# Altium project Mazda3_IC_MITM.PrjPCB
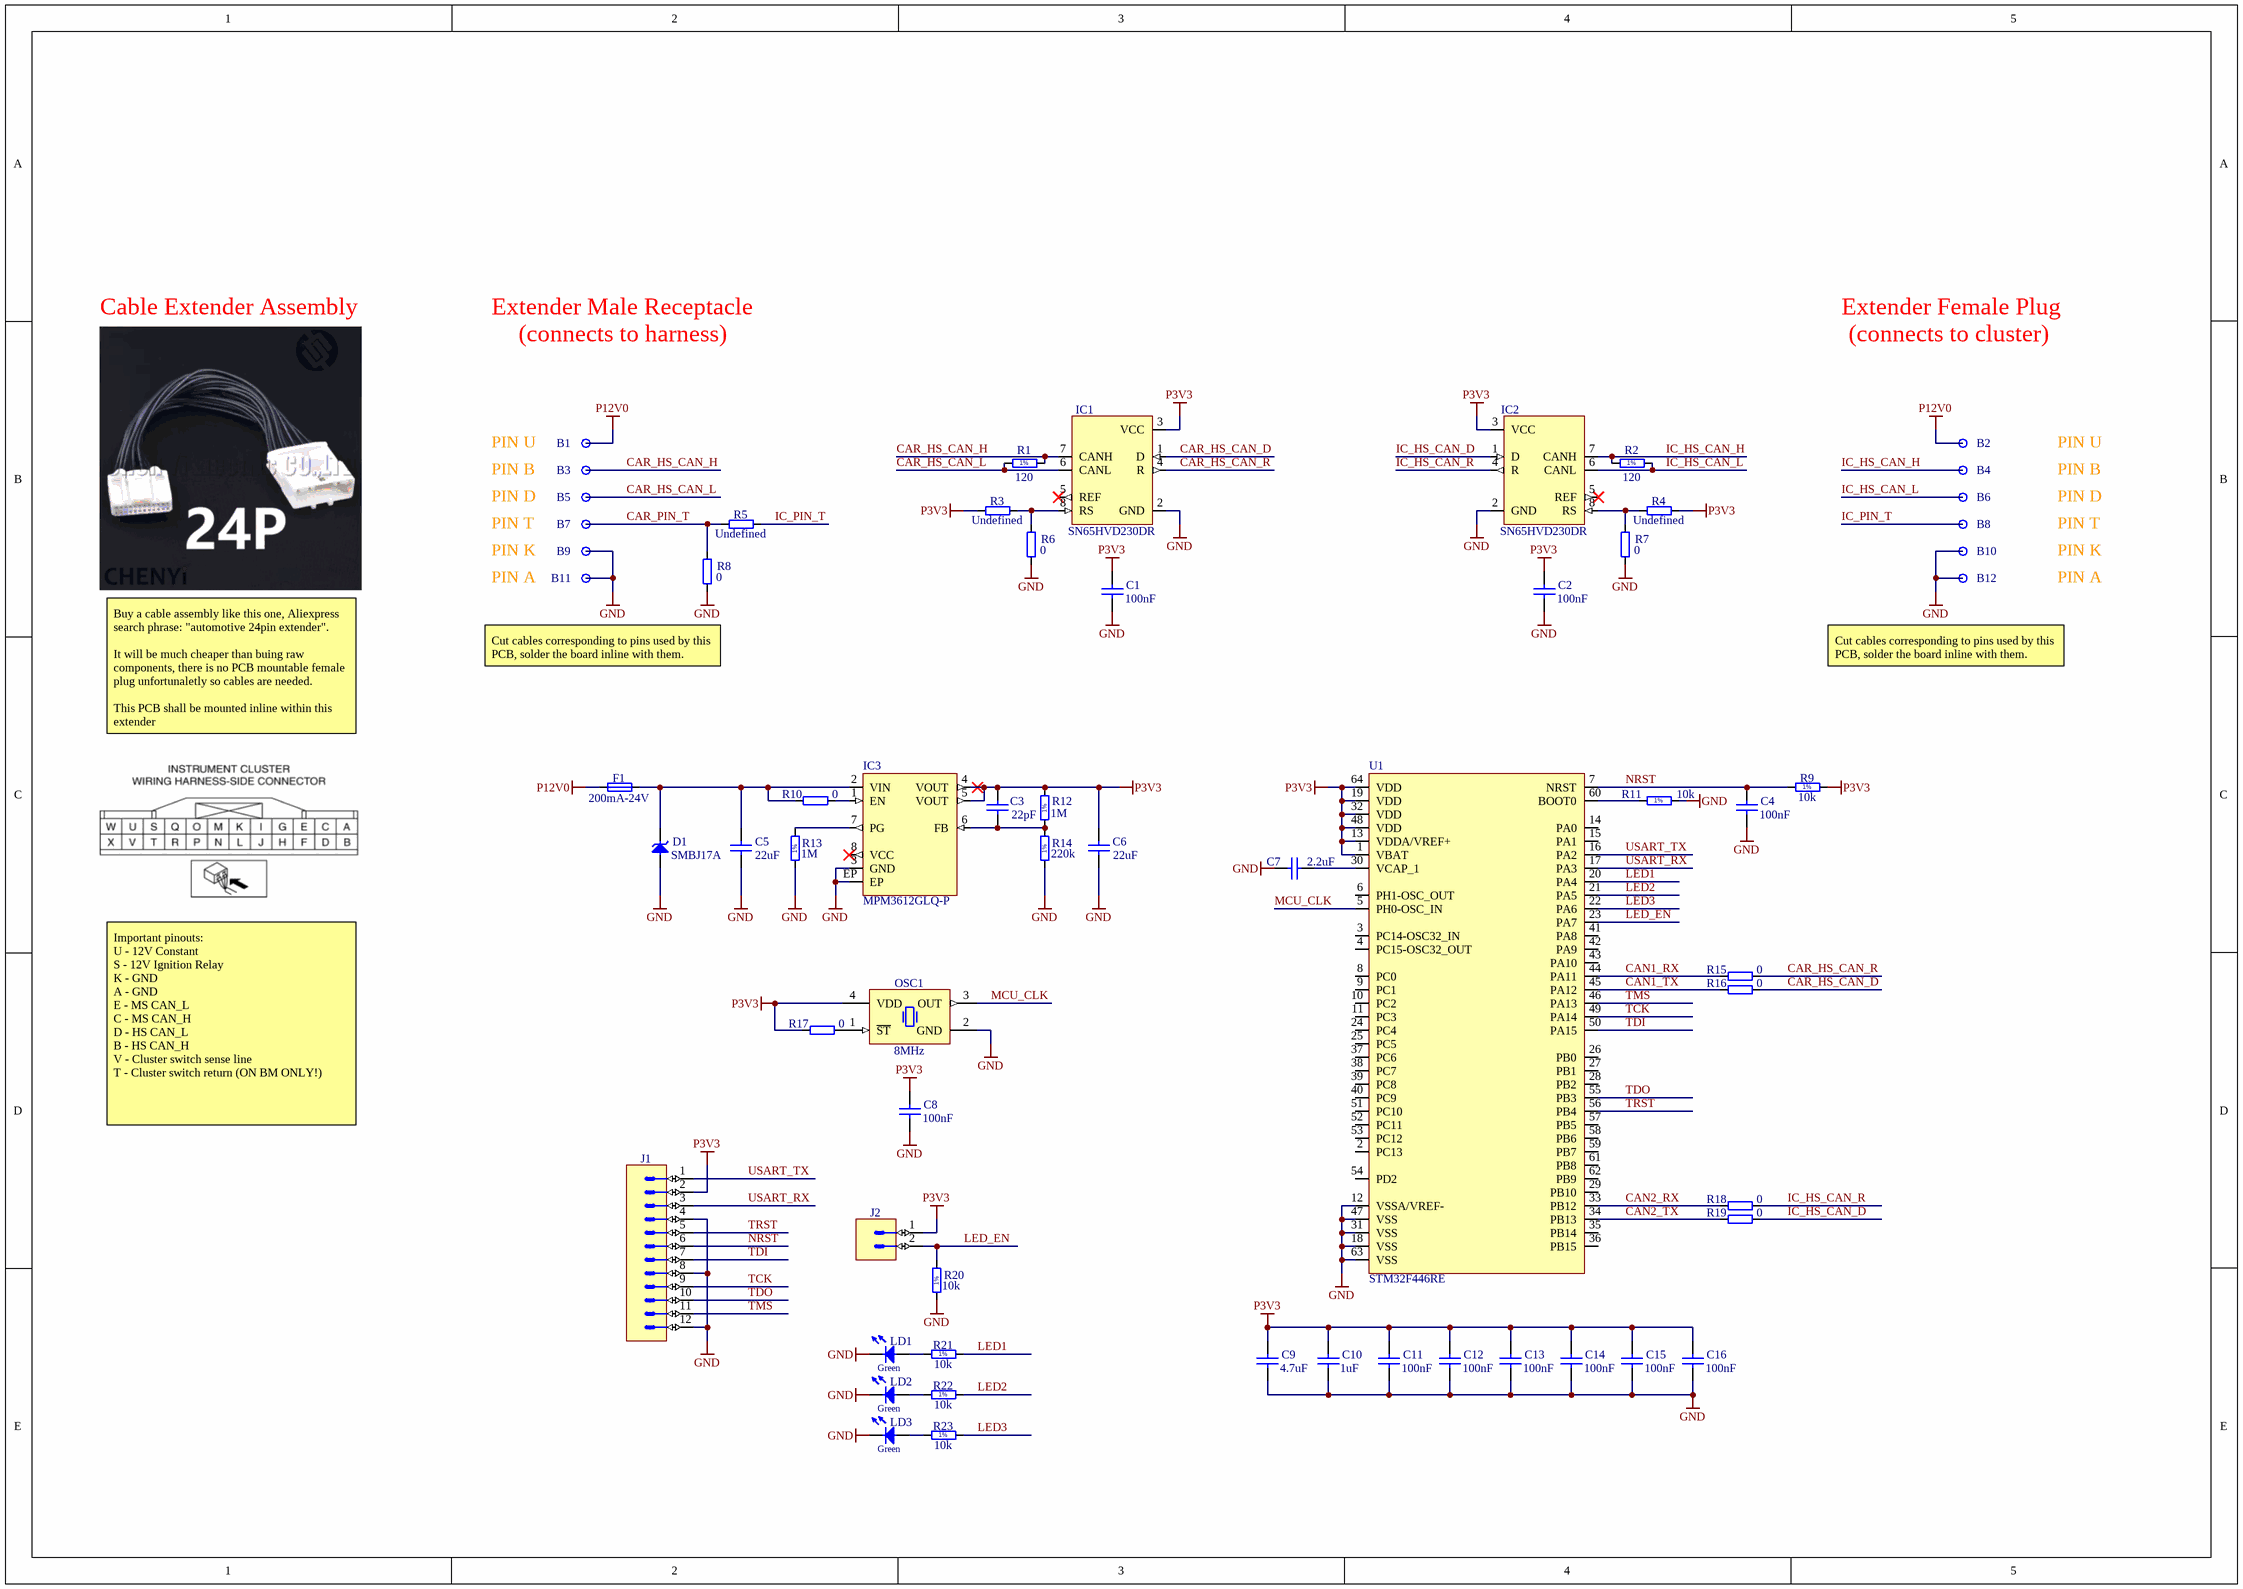
[diagram p0: Top.SchDoc]
P_version: 1.5.6
1 sheet, 63 parts. Net scope: hierarchical (ports join the sheet entries above them; power ports are global).
Board file: Pcb.PcbDoc

## Sheet Top.SchDoc: 3U DDS (URUKUL)
size 420 x 297 mm; Author: G.K.; CompanyName: WUT; DrawnBy: G.K.; Organization: WUT ISE; Address1: Warsaw Univeristy of Technology; Address2: Nowowiejska 15/19; DocumentNumber: 1; Revision: 1.5.6; SheetNumber: 1; SheetTotal: 7; EDA_Number: ARTIQ; Projet: ARTIQ/SINARA; ModifiedBy: -; CreateDate: XX/XX/XXXX; CheckedDate: -; Title2: Top entity; DivGrp: ISE; Designer: G.K.; ModifiedDate: -; ProjectName: ARTIQ/SINARA

### Parts
B1  Plated Hole  [c170h100]  (value not drawn)  (no BOM)
B2  Plated Hole  [c170h100]  (value not drawn)  (no BOM)
B3  Plated Hole  [c170h100]  (value not drawn)  (no BOM)
B4  Plated Hole  [c170h100]  (value not drawn)  (no BOM)
B5  Plated Hole  [c170h100]  (value not drawn)  (no BOM)
B6  Plated Hole  [c170h100]  (value not drawn)  (no BOM)
B7  Plated Hole  [c170h100]  (value not drawn)  (no BOM)
B8  Plated Hole  [c170h100]  (value not drawn)  (no BOM)
B9  Plated Hole  [c170h100]  (value not drawn)  (no BOM)
B10  Plated Hole  [c170h100]  (value not drawn)  (no BOM)
B11  Plated Hole  [c170h100]  (value not drawn)  (no BOM)
B12  Plated Hole  [c170h100]  (value not drawn)  (no BOM)
C1  100nF  [CAPC1608X87N]
C2  100nF  [CAPC1608X87N]
C3  22pF  [CAPC1608X87N]
C4  100nF  [CAPC1608X87N]
C5  22uF  [CAPC2012X135N]
C6  22uF  [CAPC2012X135N]
C7  2.2uF  [CAPC1608X90N]
C8  100nF  [CAPC1608X87N]
C9  4.7uF  [CAPC1608X87N]
C10  1uF  [CAPC1608X87N]
C11  100nF  [CAPC1608X87N]
C12  100nF  [CAPC1608X87N]
C13  100nF  [CAPC1608X87N]
C14  100nF  [CAPC1608X87N]
C15  100nF  [CAPC1608X87N]
C16  100nF  [CAPC1608X87N]
D1  SMBJ17A  [DIOM5336X265N]
F1  200mA-24V  [FUSR_LITTELFUSE_0805L010]
IC1  SN65HVD230DR  [SOIC127P600X175-8N]
IC2  SN65HVD230DR  [SOIC127P600X175-8N]
IC3  MPM3612GLQ-P  [LGA10]
J1  Header 12  [SAMTEC_TSW-106-23-L-D]  (value not drawn)
J2  Header 2  [SAMTEC_TSW-101-23-L-D]  (value not drawn)
LD1  Green  [LED_KINGBRIGHT_KPH-1608CGCK]
LD2  Green  [LED_KINGBRIGHT_KPH-1608CGCK]
LD3  Green  [LED_KINGBRIGHT_KPH-1608CGCK]
OSC1  8MHz  [OSC_MICROCHIP_CDFN2520-4LD-PL-1]
R1  120  [RESC3216X65N]
R2  120  [RESC3216X65N]
R3  Undefined  [RESC1608X55N]
R4  Undefined  [RESC1608X55N]
R5  Undefined  [RESC1608X55N]
R6  0  [RESC1608X55N]
R7  0  [RESC1608X55N]
R8  0  [RESC1608X55N]
R9  10k  [RESC1608X55N]
R10  0  [RESC1608X55N]
R11  10k  [RESC1608X55N]
R12  1M  [RESC1608X55N]
R13  1M  [RESC1608X55N]
R14  220k  [RESC1608X55N]
R15  0  [RESC1608X55N]
R16  0  [RESC1608X55N]
R17  0  [RESC1608X55N]
R18  0  [RESC1608X55N]
R19  0  [RESC1608X55N]
R20  10k  [RESC1608X55N]
R21  10k  [RESC1608X55N]
R22  10k  [RESC1608X55N]
R23  10k  [RESC1608X55N]
U1  STM32F446RE  [STM-LQFP64_N]

### Nets
GND: B9.1 B10.1 B11.1 B12.1 C1.1 C2.1 C4.1 C5.1 C6.1 C7.1 C8.1 C9.1 C10.1 C11.1 C12.1 C13.1 C14.1 C15.1 C16.1 D1.2(A) IC1.2(GND) IC2.2(GND) IC3.3(GND) IC3.EP J1.4 J1.8 J1.12 LD1.1(C) LD2.1(C) LD3.1(C) OSC1.2(GND) R6.1 R7.1 R8.1 R11.2 R13.1 R14.1 R20.1 U1.12(VSSA/VREF-) U1.18(VSS) U1.31(VSS) U1.47(VSS) U1.63(VSS)
P3V3: C1.2 C2.2 C3.2 C6.2 C8.2 C9.2 C10.2 C11.2 C12.2 C13.2 C14.2 C15.2 C16.2 IC1.3(VCC) IC2.3(VCC) IC3.4(VOUT) IC3.5(VOUT) J1.2 J2.1 OSC1.4(VDD) R3.2 R4.2 R9.2 R12.2 R17.2 U1.1(VBAT) U1.13(VDDA/VREF+) U1.19(VDD) U1.32(VDD) U1.48(VDD) U1.64(VDD)
P12V0: B1.1 B2.1 F1.1
CAN1_RX: R15.2 U1.44(PA11)
CAN1_TX: R16.2 U1.45(PA12)
CAN2_RX: R18.2 U1.33(PB12)
CAN2_TX: R19.2 U1.34(PB13)
CAR_HS_CAN_D: IC1.1(D) R16.1
CAR_HS_CAN_H: B3.1 IC1.7(CANH) R1.1
CAR_HS_CAN_L: B5.1 IC1.6(CANL) R1.2
CAR_HS_CAN_R: IC1.4(R) R15.1
CAR_PIN_T: B7.1 R5.1 R8.2
IC_HS_CAN_D: IC2.1(D) R19.1
IC_HS_CAN_H: B4.1 IC2.7(CANH) R2.1
IC_HS_CAN_L: B6.1 IC2.6(CANL) R2.2
IC_HS_CAN_R: IC2.4(R) R18.1
IC_PIN_T: B8.1 R5.2
LED1: R21.2 U1.20(PA4)
LED2: R22.2 U1.21(PA5)
LED3: R23.2 U1.22(PA6)
LED_EN: J2.2 R20.2 U1.23(PA7)
MCU_CLK: OSC1.3(OUT) U1.5(PH0-OSC_IN)
NRST: C4.2 J1.6 R9.1 U1.7(NRST)
TCK: J1.9 U1.49(PA14)
TDI: J1.7 U1.50(PA15)
TDO: J1.10 U1.55(PB3)
TMS: J1.11 U1.46(PA13)
TRST: J1.5 U1.56(PB4)
USART_RX: J1.3 U1.17(PA3)
USART_TX: J1.1 U1.16(PA2)
NetC3_1: C3.1 IC3.6(FB) R12.1 R14.2
NetC5_2: C5.2 D1.1(C) F1.2 IC3.2(VIN) R10.2
NetC7_2: C7.2 U1.30(VCAP_1)
NetIC1_8: IC1.8(RS) R3.1 R6.2
NetIC2_8: IC2.8(RS) R4.1 R7.2
NetIC3_1: IC3.1(EN) R10.1
NetIC3_7: IC3.7(PG) R13.2
NetLD1_2: LD1.2(A) R21.1
NetLD2_2: LD2.2(A) R22.1
NetLD3_2: LD3.2(A) R23.1
NetOSC1_1: OSC1.1(~{ST}) R17.1
NetR11_1: R11.1 U1.60(BOOT0)

Not connected (* = marked no-connect by the designer): IC1 5(REF)*; IC2 5(REF)*; IC3 8(VCC)*; U1 2(PC13) 3(PC14-OSC32_IN) 4(PC15-OSC32_OUT) 6(PH1-OSC_OUT) 8(PC0) 9(PC1) 10(PC2) 11(PC3) 14(PA0) 15(PA1) 24(PC4) 25(PC5) 26(PB0) 27(PB1) 28(PB2) 29(PB10) 35(PB14) 36(PB15) 37(PC6) 38(PC7) 39(PC8) 40(PC9) 41(PA8) 42(PA9) 43(PA10) 51(PC10) 52(PC11) 53(PC12) 54(PD2) 57(PB5) 58(PB6) 59(PB7) 61(PB8) 62(PB9)

### Notes on the sheet
- Cable Extender Assembly
- Extender Male Receptacle
- Extender Female Plug
- (connects to harness)
- (connects to cluster)
- PIN U
- PIN B
- PIN D
- PIN T
- PIN K
- PIN A
- Cut cables corresponding to pins used by this PCB, solder the board inline with them.
- Buy a cable assembly like this one, Aliexpress search phrase: "automotive 24pin extender".
  It will be much cheaper than buing raw components, there is no PCB mountable female plug unfortunaletly so cables are needed.
  This PCB shall be mounted inline within this extender
- Important pinouts:
  U - 12V Constant
  S - 12V Ignition Relay
  K - GND
  A - GND
  E - MS CAN_L
  C - MS CAN_H
  D - HS CAN_L
  B - HS CAN_H
  V - Cluster switch sense line
  T - Cluster switch return (ON BM ONLY!)
- (in symbol R0603_1M_1%_0.1W_100PPM) 1%
- (in symbol R0603_10K_1%_0.1W_100PPM) 1%
- (in symbol R0603_220K_1%_0.1W_100PPM) 1%
- (in symbol R1206_120R_1%_0.25W_100PPM) 1%

### Library data of the parts
B1-B12 = PLATED_HOLE1.0_PAD1.7: Single Terminal Socket; Part Description: Plated Through Hole: Hole Dia.=1.0mm Pad Dia.=1.7mm,  IPC-7251 Level A; Mounted: No; Part Number: PLATED_HOLE1.0_PAD1.7; Component Type: Standard (No BOM); Pin Count: 1; Family: Plated Hole; Socket: No; SMD: No; Sense: No; Status: None; ComponentHeight: 0mm; HelpURL: Undefined; Author: CERN DEM JLC; CreateDate: 11/05/2017; LatestRevisionDate: 11/05/2017; PackageDescription: Plated Through Hole: Hole Dia.=1.0mm Pad Dia.=1.7mm,  IPC-7251 Level A
C1 C2 C4 C8 C11-C16 = CC0603_100NF_50V_10%_X5R: Non-polarised capacitor; Part Description: SMD Multilayer Chip Ceramic Capacitor; Manufacturer: GENERIC; Manufacturer1: TDK; Manufacturer1 Part Number: C1608X5R1H104K080AA; Voltage: 50V; TC: X5R; Tolerance: ±10%; Part Number: CC0603_100NF_50V_10%_X5R; Component Kind: Standard; Component Type: Standard; Pin Count: 2; Value: 100nF; Status: None; Manufacturer Part Number: CC0603_100NF_50V_10%_X5R; Case: 0603; Mounted: Yes; Socket: No; SMD: Yes; Sense: No; Manufacturer1 ComponentHeight: 0.9mm; HelpURL: \\cern.ch\dfs\Applications\Altium\Datasheets\CC0603_X5R_TDK_C.pdf; Author: CERN DEM MR; CreateDate: 08/01/2016; LatestRevisionDate: 08/01/2016
C3 = CC0603_22PF_50V_5%_NP0: Non-polarised capacitor; Part Description: SMD Multilayer Chip Ceramic Capacitor; Manufacturer: GENERIC; Manufacturer1: PHYCOMP; Manufacturer1 Part Number: 223886715229; Voltage: 50V; TC: C0G/NP0; Tolerance: ±5%; Part Number: CC0603_22PF_50V_5%_NP0; Component Kind: Standard; Component Type: Standard; Pin Count: 2; Value: 22pF; Status: Preferred; Manufacturer Part Number: CC0603_22PF_50V_5%_NP0; Case: 0603; Mounted: Yes; Socket: No; SMD: Yes; Sense: No; Manufacturer1 ComponentHeight: 0.87mm; HelpURL: \\cern.ch\dfs\Applications\Altium\Datasheets\CC0603_NP0_PHYCOMP.pdf; Author: CERN DEM JLC; CreateDate: 03/12/2007; LatestRevisionDate: 03/12/2007
C5 C6 = CC0805_22UF_16V_10%_X5R: Non-polarised capacitor; Part Number: CC0805_22UF_25V_20%_X6S; Part Description: SMD Multilayer Chip Ceramic Capacitor; Manufacturer: GENERIC; Manufacturer1: Samsung; Manufacturer1 Part Number: CL21X226MAYNNWE; Voltage: 25V; TC: X6S; Tolerance: ±20%; Component Kind: Standard; Component Type: Standard; Pin Count: 2; Value: 22uF; Status: Preferred; Manufacturer Part Number: CC0805_22UF_25V_20%_X6S; Case: 0805; Mounted: Yes; Socket: No; SMD: Yes; Sense: No; Manufacturer1 ComponentHeight: 1.35mm; HelpURL: \\cern.ch\dfs\Applications\Altium\Datasheets\CC0805_X5R_TDK_C.pdf; Author: CERN DEM JLC; CreateDate: 25/10/2012; LatestRevisionDate: 25/10/2012
C7 = CC0603_2.2UF_10V_20%_X7R: Non-polarised capacitor; Part Description: SMD Multilayer Chip Ceramic Capacitor; Manufacturer: GENERIC; Manufacturer1: TAIYO YUDEN; Manufacturer1 Part Number: LMK107B7225MA-T; Voltage: 10V; TC: X7R; Tolerance: ±20%; Part Number: CC0603_2.2UF_10V_20%_X7R; Component Kind: Standard; Component Type: Standard; Pin Count: 2; Value: 2.2uF; Status: Not Recommended; Manufacturer Part Number: CC0603_2.2UF_10V_20%_X7R; Case: 0603; Mounted: Yes; Socket: No; SMD: Yes; Sense: No; Manufacturer1 ComponentHeight: 0.9mm; HelpURL: \\cern.ch\dfs\Applications\Altium\Datasheets\CC0603_X7R_TAIYO-YUDEN_HIGH-VALUE.pdf; Author: CERN DEM JLC; CreateDate: 22/06/2011; LatestRevisionDate: 27/06/2011
C9 = CC0603_4.7UF_6.3V_10%_X5R: Non-polarised capacitor; Part Description: SMD Multilayer Chip Ceramic Capacitor; Manufacturer: GENERIC; Manufacturer1: PHYCOMP; Manufacturer1 Part Number: 225520613672; Voltage: 6.3V; TC: X5R; Tolerance: ±10%; Part Number: CC0603_4.7UF_6.3V_10%_X5R; Component Kind: Standard; Component Type: Standard; Pin Count: 2; Value: 4.7uF; Status: Preferred; Manufacturer Part Number: CC0603_4.7uF_6.3V_10%_X5R; Case: 0603; Mounted: Yes; Socket: No; SMD: Yes; Sense: No; Manufacturer1 ComponentHeight: 0.87mm; HelpURL: \\cern.ch\dfs\Applications\Altium\Datasheets\CC0805_X5R_PHYCOMP_HC.pdf; Author: CERN DEM JLC; CreateDate: 03/12/2007; LatestRevisionDate: 03/12/2007
C10 = CC0603_1UF_16V_10%_X7R: Non-polarised capacitor; Part Description: SMD Multilayer Chip Ceramic Capacitor; Manufacturer: GENERIC; Manufacturer1: YAGEO PHYCOMP; Manufacturer1 Part Number: 223878615663; Voltage: 16V; TC: X7R; Tolerance: ±10%; Part Number: CC0603_1UF_16V_10%_X7R; Component Kind: Standard; Component Type: Standard; Pin Count: 2; Value: 1uF; Status: None; Manufacturer Part Number: CC0603_1uF_16V_10%_X7R; Case: 0603; Mounted: Yes; Socket: No; SMD: Yes; Sense: No; Manufacturer1 ComponentHeight: 0.9mm; HelpURL: \\cern.ch\dfs\Applications\Altium\Datasheets\CC0603_X7R_PHYCOMP.pdf; Author: CERN DEM JLC; CreateDate: 03/12/2007; LatestRevisionDate: 17/04/2015
D1 = SMBJ15A: Zener Diode; Part Description: Uni-Directional Transient Voltage Suppressor Diode; Manufacturer1: FAIRCHILD SEMICONDUCTOR; Voltage: 17V; Power: 600W; PressFit: No; Bonding: No; Part Number: SMBJ17A; Component Kind: Standard; Component Type: Standard; Device: SMBJ17A; PackageDescription: DO-214-AA/SMB Diode, Molded Body; 5.34mm L X 3.625mm W X 2.65mm H, IPC Medium Density; Manufacturer1 Part Number: SMBJ17A; Pin Count: 2; Case: DO-214AA; Mounted: Yes; Socket: No; SMD: Yes; Sense: No; ComponentHeight: 2.65mm; HelpURL: \\cern.ch\dfs\Applications\Altium\Datasheets\SMBJ.pdf; Author: CERN DEM JLC; CreateDate: 08.12.2008; LatestRevisionDate: 19.12.2011
F1 = FUSR_LITTELFUSE_0805L010YR: Fuse; Part Number: 0805L020/24YR; Part Description: POLYFUSE® Surface Mount Resettable PTC; PressFit: No; Component Kind: Standard; Component Type: Standard; Footprint: 0805L; Pin Count: 2; PackageDescription: Surface Mount POLY-FUSE® Resettable PTC, 0805L Series; Family: Fuses Resettable; Mounted: Yes; Socket: No; SMD: Yes; Sense: No; Value: 200mA-24V; Manufacturer1: LITTELFUSE; Manufacturer1 Part Number: 0805L020/24YR; ComponentHeight: 1mm; HelpURL: \\cern.ch\dfs\Applications\Altium\Datasheets\FUSR_LITTELFUSE_0805L010YR.pdf; Author: CERN DEM JLC; CreateDate: 11/09/2012; LatestRevisionDate: 11/09/2012
IC1 IC2 = SN65HVD230DR: 3.3V CAN Bus Transceiver; Manufacturer1: TEXAS INSTRUMENTS; PressFit: No; Bonding: No; Part Number: SN65HVD230DR; Component Kind: Standard; Component Type: Standard; Device: SN65HVD230DR; PackageDescription: SOIC 8, Pitch 1.27mm, Body 4x5mm, IPC Medium Density; Part Description: 3.3V CAN Bus Transceiver; Manufacturer1 Part Number: SN65HVD230DR; Pin Count: 8; Case: SOIC8; Mounted: Yes; Socket: No; SMD: Yes; Sense: No; ComponentHeight: 1.75mm; Author: CERN DEM JMW; HelpURL: \\cern.ch\dfs\Applications\Altium\Datasheets\SN65HVD233DG4.pdf; CreateDate: 22/10/2015; LatestRevisionDate: 22/10/2015
IC3 = MPM3612GLQ-P: Manufacturer1: MPS; Part Number: MPM3612GLQ-P; Manufacturer1 Part Number: MPM3612GLQ-P
J1 = SAMTEC_TSW-106-23-L-D: Connector 12 Male; Part Description: 12 Contacts, Pitch 2.54mm, Dual Row Through Mount Straight Header (Post Lead 5.84mm, Tail Lead 2.92mm, Insulator 2.54mm); Manufacturer1: SAMTEC; PressFit: No; Part Number: SAMTEC_TSW-106-23-L-D; Component Kind: Standard; Component Type: Standard; Pin Count: 12; Family: Header 12; Mounted: Yes; Socket: No; SMD: No; Sense: No; Status: None; Manufacturer1 Part Number: TSW-106-23-L-D; ComponentHeight: 8.38mm; HelpURL: \\cern.ch\dfs\Applications\Altium\Datasheets\SAMTEC_TSW-106-23-L-D.pdf; Author: CERN DEM MR; CreateDate: 08/03/2017; LatestRevisionDate: 08/03/2017
J2 = SAMTEC_TSW-101-23-L-D: Connector 2 Male; Part Description: 2 Contacts, Pitch 2.54mm, Dual Row Through Mount Straight Header (Post Lead 5.84mm, Tail Lead 2.92mm, Insulator 2.54mm); Manufacturer1: SAMTEC; PressFit: No; Part Number: SAMTEC_TSW-101-23-L-D; Component Kind: Standard; Component Type: Standard; Pin Count: 2; Family: Header 2; Mounted: Yes; Socket: No; SMD: No; Sense: No; Status: None; Manufacturer1 Part Number: TSW-101-23-L-D; ComponentHeight: 8.38mm; HelpURL: \\cern.ch\dfs\Applications\Altium\Datasheets\SAMTEC_TSW-101-23-L-D.pdf; Author: CERN DEM MR; CreateDate: 08/03/2017; LatestRevisionDate: 08/03/2017
LD1-LD3 = LED_KINGBRIGHT_KPH-1608CGCK: LED Green 1C 2A; Part Description: SMD Green LED, Case 1.6mmX0.8mm(0603), 0.65mm Thickness; PressFit: No; Bonding: No; Part Number: LED_KINGBRIGHT_KPH-1608CGCK; Component Kind: Standard; Component Type: Standard; Color: Green; PackageDescription: SMT Green LED, Case 0603, Body L 1.6 x W 0.8mm H 0.65mm; Manufacturer1: KINGBRIGHT; Manufacturer1 Part Number: KPH-1608CGCK; Pin Count: 2; Mounted: Yes; Socket: No; SMD: Yes; Sense: No; ComponentHeight: 0.65mm; HelpURL: \\cern.ch\dfs\Applications\Altium\Datasheets\LED_KINGBRIGHT_KPH-1608CGCK.pdf; Author: CERN DEM JLC; CreateDate: 03/07/2017; LatestRevisionDate: 03/07/2017
OSC1 = OSC_25MHZ_MICROCHIP_DSC1003DL5-025.0000: Oscillator 4 pins 1=S\T\ 2=GND 3=OUT 4=VDD; Part Number: OSC_8MHZ_MICROCHIP_DSC1003DL2-008.0000; Part Description: 1.8V-3.3V, ±10ppm, 25pF, -40..105°C, Surface Mount Low-Power Precision CMOS Oscillator (DSC1001 Series); Manufacturer1: MICROCHIP TECHNOLOGY; Manufacturer1 Part Number: DSC1003DL2-008.0000; PressFit: No; Bonding: No; Component Kind: Standard; Component Type: Standard; PackageDescription: MICROCHIP Case CDFN2520-4LD-PL-1, SMD Oscillator, DFN, 4 pins, 2.5mm x 2.0mm; Value: 8MHz; Pin Count: 4; Mounted: Yes; Socket: No; SMD: Yes; Sense: No; ComponentHeight: 0.9mm; HelpURL: \\cern.ch\dfs\Applications\Altium\Datasheets\OSC_MICROCHIP_DSC1003.pdf; Author: CERN DEM JLC; CreateDate: 16/08/2018; LatestRevisionDate: 16/08/2018
R1 R2 = R1206_120R_1%_0.25W_100PPM: Resistor - 1%; Part Description: General Purpose Thick Film Chip Resistor; Manufacturer: GENERIC; Manufacturer1: NIC COMPONENT; Manufacturer1 Part Number: NRC12F1200TRF; Power: 0.25W; TC: ±100ppm/°C; PressFit: No; Part Number: R1206_120R_1%_0.25W_100PPM; Component Kind: Standard; Component Type: Standard; Pin Count: 2; Value: 120; Status: Preferred; Tolerance: ±1%; Manufacturer Part Number: R1206_120R_1%_0.25W_100PPM; Case: 1206; Mounted: Yes; Sense: No; Socket: No; SMD: Yes; Manufacturer1 ComponentHeight: 0.65mm; HelpURL: \\cern.ch\dfs\Applications\Altium\Datasheets\R1206_NIC_NRC.pdf; Author: CERN DEM JLC; CreateDate: 03/12/2007; LatestRevisionDate: 13/03/2008
R3-R5 = R0603_NO-VALUE: Resistor; Part Description: Reserved Footprint For a 0603 (1608) Chip Resistor; PressFit: No; Mounted: No; Part Number: R0603_NO-VALUE; Component Kind: Standard; Component Type: Standard; Pin Count: 2; Value: Undefined; Status: None; Manufacturer: Undefined; Manufacturer Part Number: R0603_NO-VALUE; Case: 0603; Sense: No; Socket: No; SMD: Yes; Manufacturer1 Example: Undefined; Manufacturer1 Part Number: Undefined; Manufacturer1 ComponentHeight: Undefined; HelpURL: Undefined; Author: CERN DEM JLC; CreateDate: 03.12.2007; LatestRevisionDate: 13.03.2008
R6-R8 R10 R15-R19 = R0603_0R_JUMPER: Resistor; Part Description: 1A (0.05R Max DC Resistance) Zero Ohm Jumper; Manufacturer: GENERIC; Manufacturer1: NIC COMPONENT; Manufacturer1 Part Number: NRC06Z0; PressFit: No; Part Number: R0603_0R_JUMPER; Component Kind: Standard; Component Type: Standard; Pin Count: 2; Value: 0; Status: Preferred; Manufacturer Part Number: R0603_0R_JUMPER; Case: 0603; Mounted: Yes; Sense: No; Socket: No; SMD: Yes; Manufacturer1 ComponentHeight: 0.55mm; HelpURL: \\cern.ch\dfs\Applications\Altium\Datasheets\R0603_NIC_NRC.pdf; Author: CERN DEM JLC; CreateDate: 03.12.2007; LatestRevisionDate: 13.03.2008
R9 R11 R20-R23 = R0603_10K_1%_0.1W_100PPM: Resistor - 1%; Part Description: General Purpose Thick Film Chip Resistor; Manufacturer: GENERIC; Manufacturer1: NIC COMPONENT; Manufacturer1 Part Number: NRC06F1002TRF; Power: 0.1W; TC: ±100ppm/°C; PressFit: No; Part Number: R0603_10K_1%_0.1W_100PPM; Component Kind: Standard; Component Type: Standard; Pin Count: 2; Value: 10k; Status: Preferred; Tolerance: ±1%; Manufacturer Part Number: R0603_10K_1%_0.1W_100PPM; Case: 0603; Mounted: Yes; Sense: No; Socket: No; SMD: Yes; Manufacturer1 ComponentHeight: 0.55mm; HelpURL: \\cern.ch\dfs\Applications\Altium\Datasheets\R0603_NIC_NRC.pdf; Author: CERN DEM JLC; CreateDate: 03/12/2007; LatestRevisionDate: 13/03/2008
R12 R13 = R0603_1M_1%_0.1W_100PPM: Resistor - 1%; Part Description: General Purpose Thick Film Chip Resistor; Manufacturer: GENERIC; Manufacturer1: NIC COMPONENT; Manufacturer1 Part Number: NRC06F1004TRF; Power: 0.1W; TC: ±100ppm/°C; PressFit: No; Part Number: R0603_1M_1%_0.1W_100PPM; Component Kind: Standard; Component Type: Standard; Pin Count: 2; Value: 1M; Status: Preferred; Tolerance: ±1%; Manufacturer Part Number: R0603_1M_1%_0.1W_100PPM; Case: 0603; Mounted: Yes; Sense: No; Socket: No; SMD: Yes; Manufacturer1 ComponentHeight: 0.55mm; HelpURL: \\cern.ch\dfs\Applications\Altium\Datasheets\R0603_NIC_NRC.pdf; Author: CERN DEM JLC; CreateDate: 03/12/2007; LatestRevisionDate: 13/03/2008
R14 = R0603_220K_1%_0.1W_100PPM: Resistor - 1%; Part Description: General Purpose Thick Film Chip Resistor; Manufacturer: GENERIC; Manufacturer1: NIC COMPONENT; Manufacturer1 Part Number: NRC06F2203TRF; Power: 0.1W; TC: ±100ppm/°C; PressFit: No; Part Number: R0603_220K_1%_0.1W_100PPM; Component Kind: Standard; Component Type: Standard; Pin Count: 2; Value: 220k; Status: Preferred; Tolerance: ±1%; Manufacturer Part Number: R0603_220K_1%_0.1W_100PPM; Case: 0603; Mounted: Yes; Sense: No; Socket: No; SMD: Yes; Manufacturer1 ComponentHeight: 0.55mm; HelpURL: \\cern.ch\dfs\Applications\Altium\Datasheets\R0603_NIC_NRC.pdf; Author: CERN DEM JLC; CreateDate: 03/12/2007; LatestRevisionDate: 13/03/2008
U1 = STM32F446RE: Arm® Cortex®-M4 core with DSP and FPU, 512 Kbytes Flash, 180 MHz CPU, ART Accelerator, Dual QSPI; Manufacturer1: STMicroelectronics; Manufacturer1 Part Number: STM32F446RET7; Manufacturer 1 Component Height: 1.6mm; PressFit: No; DesignItemId: STM32F446RE; Author: PC; Part Number: STM32F446RE; Component Kind: Standard; Footprint: LQFP-64; HelpURL: https://www.st.com/resource/en/datasheet/stm32f446re.pdf; Mounted: Yes; Part Description: Arm® Cortex®-M4 core with DSP and FPU, 512 Kbytes Flash, 180 MHz CPU, ART Accelerator, Dual QSPI; Pin Count: 64; Sense: No; SMD: Yes; Socket: No; Supplier 1: Mouser; Supplier 2: Digi-Key; Create Date: 29/03/2020; LatestRevisionDate: 29/03/2020; Supplier Part Number 1: 511-STM32F446RET6